# Altium project SoldeerstationFinaal.PrjPcb
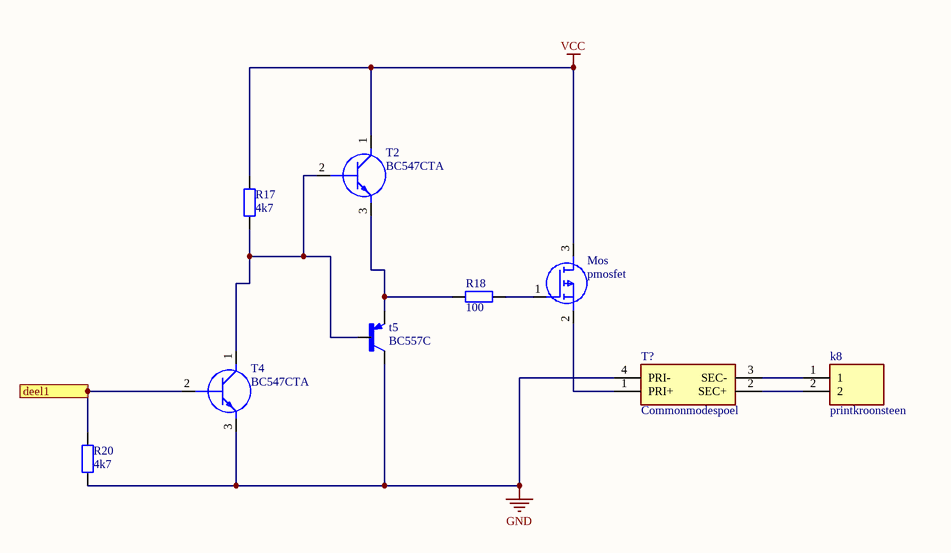
[diagram p0: deel1.SchDoc]
4 sheets, 73 parts. Net scope: flat (ports and power ports of the same name join across sheets).
Board file: PCB1.PcbDoc
Sheets:
  deel1.SchDoc
  deel2.SchDoc
  deel3.SchDoc
  deel4.SchDoc

## Sheet deel1.SchDoc
size A4; SheetNumber: 1; SheetTotal: 4

### Parts
k8  printkroonsteen  [printkroonsteen]
Mos  pmosfet  [pmosfet]
R17  4k7  [0805]
R18  100  [0805]
R20  4k7  [0805]
T2  BC547CTA  [bc447]
T4  BC547CTA  [bc447]
t5  BC557C  [bc557c]
T?  Commonmodespoel  [commonmodespoel]

### Ports
deel1

### Nets
GND: R20.1 T4.3(E) t5.1(C) T?.4(PRI-)
VCC: Mos.3(D) R17.2 T2.1(C)
Netk8_1: k8.1 T?.3(SEC-)
Netk8_2: k8.2 T?.2(SEC+)
NetMos_1: Mos.1(G) R18.2
NetMos_2: Mos.2(S) T?.1(PRI+)
NetR17_1: R17.1 T2.2(B) T4.1(C) t5.2(B)
NetR18_1: R18.1 T2.3(E) t5.3(E)
Netr19_2: R20.2 T4.2(B) ; port deel1

### Library data of the parts
k8 = printkroonsteen: Connector; Manufacturer_Name: CUI Inc.; Manufacturer_Part_Number: TB007-508-02BE; Datasheet Link: https://componentsearchengine.com//TB007-508-02BE.pdf; Height: 14mm; Mouser2 Part Number: 490-TB007-508-02BE; Mouser2 Price/Stock: https://www.mouser.com/Search/Refine.aspx?Keyword=490-TB007-508-02BE
Mos = pmosfet: MOSFET (P-Channel); Manufacturer_Name: Infineon; Manufacturer_Part_Number: IRF9Z34NPBF; Datasheet Link: https://componentsearchengine.com//IRF9Z34NPBF.pdf; Height: 4.69mm; Mouser2 Part Number: 942-IRF9Z34NPBF; Mouser2 Price/Stock: https://www.mouser.com/Search/Refine.aspx?Keyword=942-IRF9Z34NPBF
R17 R18 R20 = weerstand0805: WRIS-PSMB SMT Metal Plate Resistor, size 0805, 5mOhm, 0.5W; Manufacturer: Wurth Elektronik; Manufacturer Part Number: 580060720003; Rated Current: 10A; Temperature Coefficient of Resistance: +/-100ppm/degC; Technical Reference: MB0805R005F102KAATP0000; Resistance Tolerance: +/-1%; ComponentLink1Description: Manufacturer; ComponentLink1URL: http://www.we-online.de; ComponentLink2Description: Datasheet; ComponentLink2URL: https://www.we-online.com/catalog/datasheet/580060720003.pdf; Rated Power: 0.5W; Resistance: 5mOhm; Mounting Technology: SMT; Height: 0.35mm; Packaging: Tape and Reel; Published Date: May 2020; Size: 0805; Length: 2mm; Operating Temperature: -55 to +155degC; Width: 1.25mm
T2 T4 = BC547CTA: Transistor BJT NPN; Manufacturer_Name: ON Semiconductor; Datasheet Link: http://www.onsemi.com/pub/Collateral/BC550-D.pdf; Manufacturer_Part_Number: BC547CTA
t5 = BC557C: Bipolar (BJT) Transistor PNP 30V 100mA 150MHz 500mW Through Hole TO-92-3; MP: BC557CZL1G; Package: None; Price: None; Value: *; Availability: Unavailable
T? = Commonmodespoel: Transformer; Manufacturer_Name: Laird Technologies; Manufacturer_Part_Number: CM2545X171B-10; Datasheet Link: https://datasheet.datasheetarchive.com/originals/dk/DKDS-7/122753.pdf; Height: 9.5mm

## Sheet deel2.SchDoc
size A4; SheetNumber: 2; SheetTotal: 4
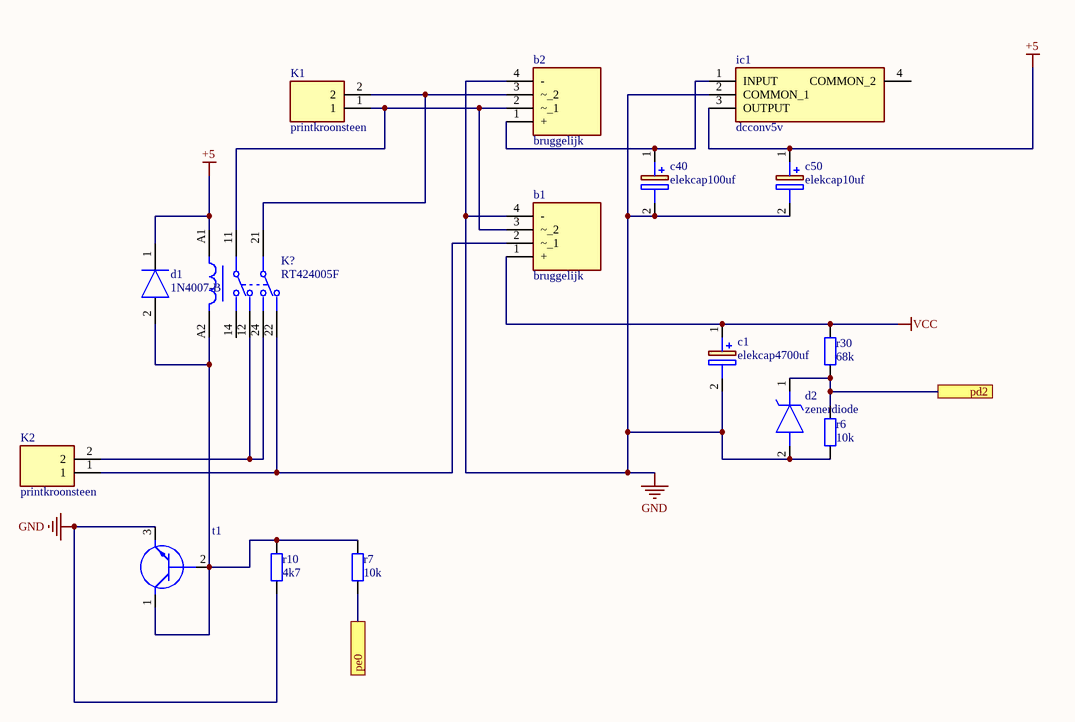
[diagram p1: deel2.SchDoc]

### Parts
(Parts that share a designator on the sheet are numbered #1, #2 ... from top to bottom, then left to right.)
b1  bruggelijk  [bruggelijk]
b2  bruggelijk  [bruggelijk]
c1  elekcap4700uf  [Elekcap4700uf]
c40  elekcap100uf  [elekcap100uf]
c50#1  elekcap10uf  [elekcap10uf]
d1  1N4007-B  [1n4007]
d2  zenerdiode  [zenerdiode]
ic1  dcconv5v  [dcconv5v]
K1  printkroonsteen  [printkroonsteen]
K2  printkroonsteen  [printkroonsteen]
K?  RT424005F  [FP-RT424005F-MFG]
r6  10k  [0805]
r7  10k  [0805]
r10  4k7  [0805]
r30  68k  [0805]
t1  (no value)  [bc447]

### Ports
pd2, pe0

### Nets
+5: c50#1.1(+) d1.1(K) ic1.3(OUTPUT) K?.A1
GND: b1.4(-) b2.4(-) c1.2(-) c40.2(-) c50#1.2(-) d2.2(A) ic1.2(COMMON_1) r6.1 r10.1 t1.3(E)
VCC: b1.1(+) c1.1(+) r30.2
Netb1_2: b1.2(~_1) K2.1 K?.22
Netb1_3: b1.3(~_2) b2.2(~_1) K1.1 K?.11
Netb2_1: b2.1(+) c40.1(+) ic1.1(INPUT)
Netb2_3: b2.3(~_2) K1.2 K?.21
Netd1_2: d1.2(A) K?.A2 r7.2 r10.2 t1.1(C) t1.2(B)
Netd2_1: d2.1(K) r6.2 r30.1 ; port pd2
NetIC5_19: r7.1 ; port pe0
NetK2_2: K2.2 K?.12 K?.24

Not connected (* = marked no-connect by the designer): ic1 4(COMMON_2); K? 14

### Library data of the parts
b1 b2 = bruggelijk: Bridge Rectifier; Manufacturer_Name: Vishay; Manufacturer_Part_Number: GBU6J-E3/45; Datasheet Link: http://www.vishay.com/docs/88615/gbu6a.pdf; Height: 18.8mm
c1 = elekcap4700uf: Capacitor Polarised; Manufacturer_Name: Kemet; Manufacturer_Part_Number: ESK478M050AQ3AA; Datasheet Link: https://componentsearchengine.com//ESK478M050AQ3AA.pdf; Height: 37mm; Mouser2 Part Number: 80-ESK478M050AQ3AA; Mouser2 Price/Stock: https://www.mouser.com/Search/Refine.aspx?Keyword=80-ESK478M050AQ3AA
c40 = elekcap100uf: Capacitor Polarised; Manufacturer_Name: Kemet; Manufacturer_Part_Number: ESH107M050AG3KA; Datasheet Link: https://connect.kemet.com:7667/gateway/IntelliData-ComponentDocumentation/1.0/download/specsheet/ESH107M050AG3KA; Height: 12.5mm
c50#1 = elekcap10uf: Capacitor Polarised; Manufacturer_Name: Panasonic; Manufacturer_Part_Number: EEU-FR1H100; Datasheet Link: https://componentsearchengine.com//EEU-FR1H100.pdf; Height: 12.5mm; Mouser2 Part Number: 667-EEU-FR1H100; Mouser2 Price/Stock: https://www.mouser.com/Search/Refine.aspx?Keyword=667-EEU-FR1H100
d1 = 1N4007-B: Diode; Manufacturer_Name: Rectron; Datasheet Link: https://www.arrow.com/en/products/1n4007-b/rectron; Manufacturer_Part_Number: 1N4007-B
d2 = zenerdiode: Zener Diode; Manufacturer_Name: Vishay; Manufacturer_Part_Number: TZMC5V1-GS08; Datasheet Link: https://componentsearchengine.com/Datasheets/2/TZMC5V1-GS08.pdf; Height: 1.6mm
ic1 = dcconv5v: Integrated Circuit; Manufacturer_Name: Texas Instruments; Manufacturer_Part_Number: TL780-05CKTTR; Datasheet Link: http://www.ti.com/general/docs/suppproductinfo.tsp?distId=26&gotoUrl=http%3A%2F%2Fwww.ti.com%2Flit%2Fgpn%2Ftl780; Height: 5.08mm
K1 K2 = printkroonsteen: as k8 on sheet deel1; Datasheet Link: https://componentsearchengine.com//TB007-508-02BE.pdf; Height: 14mm; Mouser2 Part Number: 490-TB007-508-02BE; Mouser2 Price/Stock: https://www.mouser.com/Search/Refine.aspx?Keyword=490-TB007-508-02BE
K? = CMP-03395-000296-1: RELAY GENERAL PURPOSE DPDT 8A 5V; Power Consumption: 400mW; Coil Current: 80.6mA; Max Voltage Rating (AC): 400V; Coil Power: 500mW; Dropout Voltage: 500mV; Operate Time: 7ms; Contact Voltage Rating (AC): 250V; Coil Type: Non-Latching; Coil Resistance: 62R; Release Time: 3ms; Max Operating Temperature: 85°C; Package Quantity: 5000; Relay Type: General Purpose; Series: RT2; Lead Free: Lead Free; Coil Voltage (DC): 5V; Contact Current Rating: 8A; Packaging: Carton; Height: 15.7mm; Mount: Through Hole; Width: 12.7mm; ELV: Compliant; Termination: PCB; Contact Material: Silver; Throw Configuration: DPDT; Min Operating Temperature: -40°C; Weight: 13g; RoHS Compliant: Yes; Length: 29mm; Radiation Hardening: No
r6 r7 r10 r30 = weerstand0805: as R17 on sheet deel1; ComponentLink1Description: Manufacturer; ComponentLink1URL: http://www.we-online.de; ComponentLink2Description: Datasheet; ComponentLink2URL: https://www.we-online.com/catalog/datasheet/580060720003.pdf; Rated Power: 0.5W; Resistance: 5mOhm; Mounting Technology: SMT; Height: 0.35mm; Packaging: Tape and Reel; Published Date: May 2020; Size: 0805; Length: 2mm; Operating Temperature: -55 to +155degC; Width: 1.25mm
t1 = BC547CTA: as T2 on sheet deel1; Datasheet Link: http://www.onsemi.com/pub/Collateral/BC550-D.pdf; Manufacturer_Part_Number: BC547CTA

## Sheet deel3.SchDoc
size A4; SheetNumber: 3; SheetTotal: 4
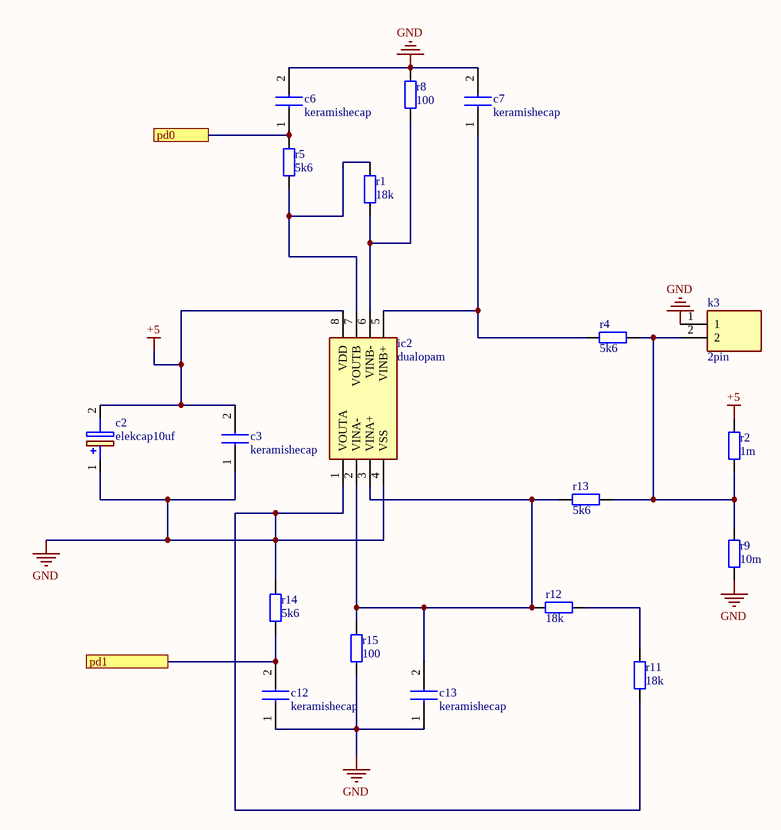
[diagram p2: deel3.SchDoc]

### Parts
c2  elekcap10uf  [elekcap10uf]
c3  keramishecap  [0805]
c6  keramishecap  [0805]
c7  keramishecap  [0805]
c12  keramishecap  [0805]
c13  keramishecap  [0805]
ic2  dualopam  [dualopam]
k3  2pin  [2pin]
r1  18k  [0805]
r2  1m  [0805]
r4  5k6  [0805]
r5  5k6  [0805]
r8  100  [0805]
r9  10m  [0805]
r11  18k  [0805]
r12  18k  [0805]
r13  5k6  [0805]
r14  5k6  [0805]
r15  100  [0805]

### Ports
pd0, pd1

### Nets
+5: c2.2(-) c3.2 ic2.8(VDD) r2.2
GND: c2.1(+) c3.1 c6.2 c7.2 c12.1 c13.1 ic2.1(VOUTA) ic2.4(VSS) k3.1 r8.2 r9.1 r11.1 r14.2 r15.1
Netc6_1: c6.1 r5.1 ; port pd0
Netc7_1: c7.1 ic2.5(VINB+) r4.1
Netc12_2: c12.2 r14.1 ; port pd1
Netc13_2: c13.2 ic2.2(VINA-) ic2.3(VINA+) r12.1 r13.1 r15.2
Netic2_6: ic2.6(VINB-) r1.1 r8.1
Netic2_7: ic2.7(VOUTB) r1.2 r5.2
Netk3_2: k3.2 r2.1 r4.2 r9.2 r13.2
Netr11_2: r11.2 r12.2

### Library data of the parts
c2 = elekcap10uf: as c50#1 on sheet deel2; Datasheet Link: https://componentsearchengine.com//EEU-FR1H100.pdf; Height: 12.5mm; Mouser2 Part Number: 667-EEU-FR1H100; Mouser2 Price/Stock: https://www.mouser.com/Search/Refine.aspx?Keyword=667-EEU-FR1H100
c3 c6 c7 c12 c13 = keramishecap: Capacitor; Manufacturer_Name: Kemet; Manufacturer_Part_Number: C1206C104K3GACAUTO; Datasheet Link: https://www.kemet.com/specsheet/C1206C104K3GACAUTO; Height: 1.8mm
ic2 = dualopam: Integrated Circuit; Manufacturer_Name: Microchip; Manufacturer_Part_Number: MCP6002-E/P; Datasheet Link: https://componentsearchengine.com//MCP6002-E_P.pdf; Height: 5.334mm; Mouser2 Part Number: 579-MCP6002-E/P; Mouser2 Price/Stock: https://www.mouser.com/Search/Refine.aspx?Keyword=579-MCP6002-E%2FP
k3 = 2pin: Connector; Manufacturer_Name: Amphenol; Manufacturer_Part_Number: 10129378-902001BLF; Datasheet Link: https://www.mouser.co.uk/datasheet/2/18/10129378-1530218.pdf; Height: 8.43mm
r1 r2 r4 r5 r8 r9 r11-r15 = weerstand0805: as R17 on sheet deel1; ComponentLink1Description: Manufacturer; ComponentLink1URL: http://www.we-online.de; ComponentLink2Description: Datasheet; ComponentLink2URL: https://www.we-online.com/catalog/datasheet/580060720003.pdf; Rated Power: 0.5W; Resistance: 5mOhm; Mounting Technology: SMT; Height: 0.35mm; Packaging: Tape and Reel; Published Date: May 2020; Size: 0805; Length: 2mm; Operating Temperature: -55 to +155degC; Width: 1.25mm

## Sheet deel4.SchDoc
size A4; SheetNumber: 4; SheetTotal: 4
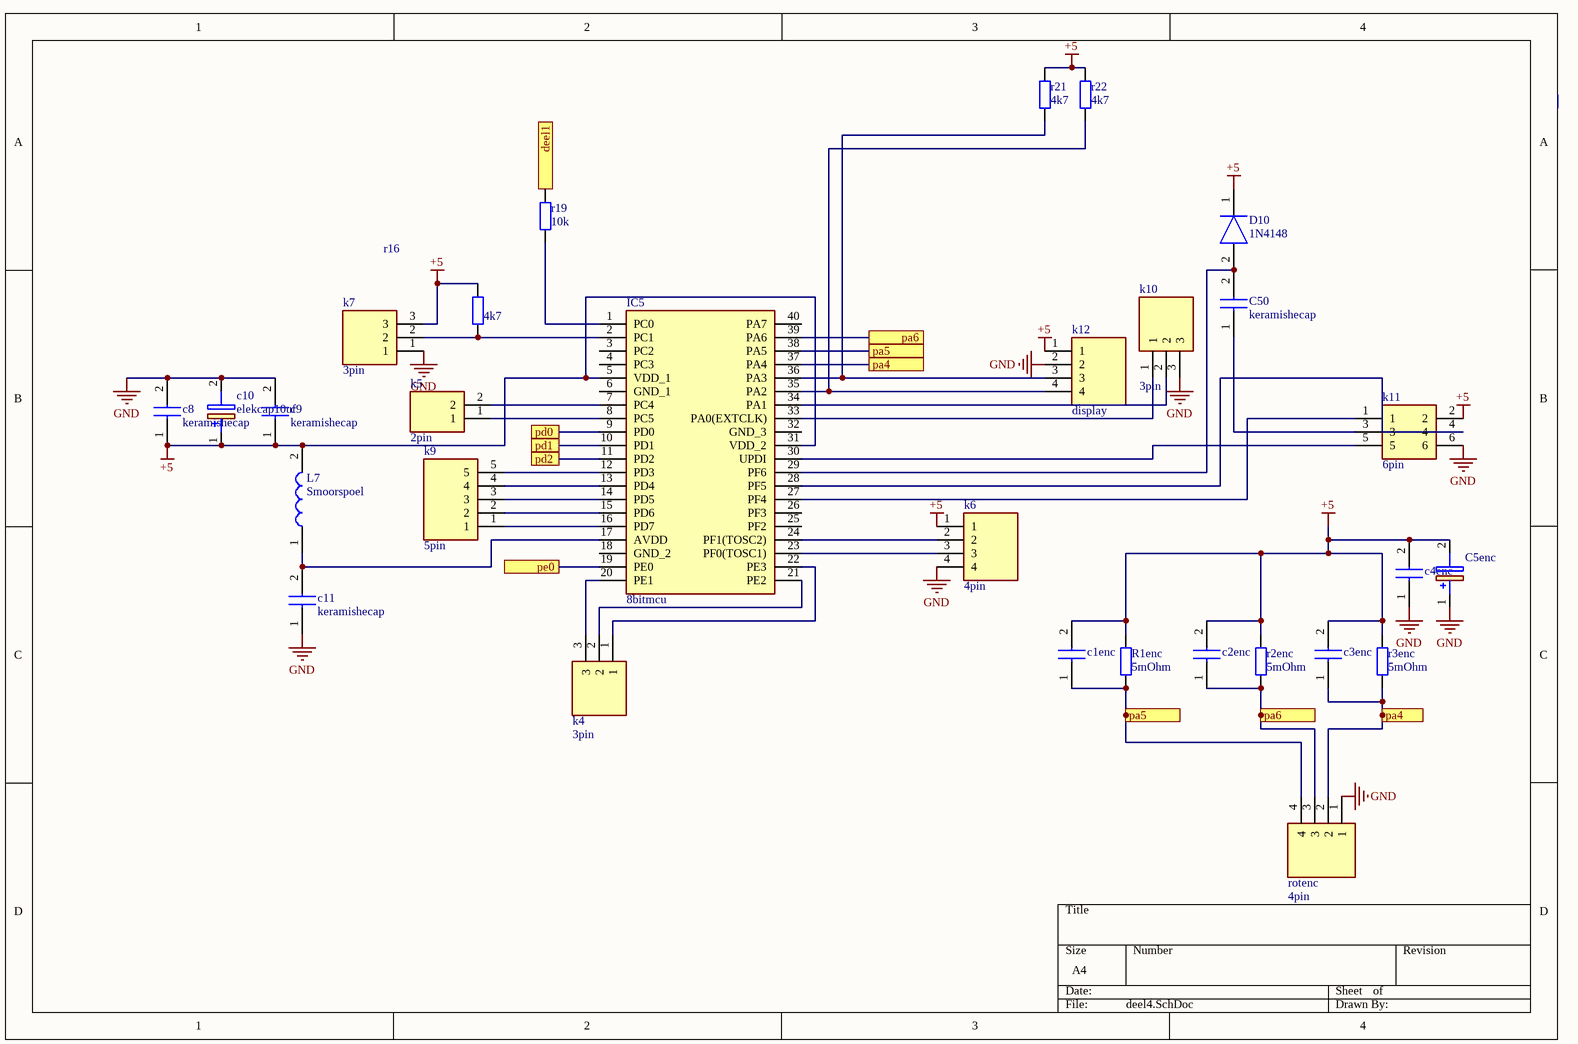
[diagram p3: deel4.SchDoc]

### Parts
(Parts that share a designator on the sheet are numbered #1, #2 ... from top to bottom, then left to right.)
c1enc  (no value)  [0805]
c2enc  (no value)  [0805]
c3enc  (no value)  [0805]
c4enc  (no value)  [0805]
C5enc  (no value)  [elekcap100uf]
c8  keramishecap  [0805]
c9  keramishecap  [0805]
c10  elekcap10uf  [elekcap10uf]
c11  keramishecap  [0805]
C50#2  keramishecap  [0805]
D10  1N4148  [diode1N4148]
IC5  8bitmcu  [8bitmcu]
k4  3pin  [3pin]
k5  2pin  [2pin]
k6  4pin  [4pin]
k7  3pin  [3pin]
k9  5pin  [5pin]
k10  3pin  [3pin]
k11  6pin  [6pin]
k12  display  [4pin]
L7  Smoorspoel  [Smoorspoel]
R1enc  5mOhm  [0805]
r2enc  5mOhm  [0805]
r3enc  5mOhm  [0805]
r16  4k7  [0805]
r19  10k  [0805]
r21  4k7  [0805]
r22  4k7  [0805]
rotenc  4pin  [4pin]

### Ports
deel1, pa4, pa5, pa6, pd0, pd1, pd2, pe0

### Nets
+5: c1enc.2 c2enc.2 c3enc.2 c4enc.2 C5enc.2(-) c8.1 c9.1 c10.1(+) D10.1(K) IC5.5(VDD_1) IC5.31(VDD_2) k6.1 k7.3 k11.2 k12.1 L7.2 R1enc.2 r2enc.2 r3enc.2 r16.2 r21.2 r22.2
GND: c4enc.1 C5enc.1(+) c8.2 c9.2 c10.2(-) c11.1 k6.4 k7.1 k10.3 k11.6 k12.2 rotenc.1
Netc1enc_1: c1enc.1 IC5.38(PA5) R1enc.1 rotenc.4 ; port pa5
Netc2enc_1: c2enc.1 IC5.39(PA6) r2enc.1 rotenc.3 ; port pa6
Netc3enc_1: c3enc.1 IC5.37(PA4) r3enc.1 rotenc.2 ; port pa4
Netc6_1: IC5.9(PD0) ; port pd0
Netc11_2: c11.2 IC5.17(AVDD) L7.1
Netc12_2: IC5.10(PD1) ; port pd1
NetC50#2_1: C50#2.1 k11.3
NetC50#2_2: C50#2.2 D10.2(A) IC5.29(PF6)
Netd2_1: IC5.11(PD2) ; port pd2
NetIC5_1: IC5.1(PC0) r19.1
NetIC5_2: IC5.2(PC1) k7.2 r16.1
NetIC5_7: IC5.7(PC4) k5.2
NetIC5_8: IC5.8(PC5) k5.1
NetIC5_12: IC5.12(PD3) k9.5
NetIC5_13: IC5.13(PD4) k9.4
NetIC5_14: IC5.14(PD5) k9.3
NetIC5_15: IC5.15(PD6) k9.2
NetIC5_16: IC5.16(PD7) k9.1
NetIC5_19: IC5.19(PE0) ; port pe0
NetIC5_20: IC5.20(PE1) k4.3
NetIC5_21: IC5.21(PE2) k4.2
NetIC5_22: IC5.22(PE3) k4.1
NetIC5_23: IC5.23(PF0(TOSC1)) k6.3
NetIC5_24: IC5.24(PF1(TOSC2)) k6.2
NetIC5_27: IC5.27(PF4) k11.1
NetIC5_28: IC5.28(PF5) k11.4
NetIC5_30: IC5.30(UPDI) k11.5
NetIC5_33: IC5.33(PA0(EXTCLK)) k10.1
NetIC5_34: IC5.34(PA1) k10.2
NetIC5_35: IC5.35(PA2) k12.4 r22.1
NetIC5_36: IC5.36(PA3) k12.3 r21.1
Netr19_2: r19.2 ; port deel1

Not connected (* = marked no-connect by the designer): IC5 3(PC2) 4(PC3) 6(GND_1) 18(GND_2) 25(PF2) 26(PF3) 32(GND_3) 40(PA7)

### Library data of the parts
c1enc c2enc c3enc c4enc c8 c9 c11 C50#2 = keramishecap: as c3 on sheet deel3; Datasheet Link: https://www.kemet.com/specsheet/C1206C104K3GACAUTO; Height: 1.8mm
C5enc = elekcap100uf: as c40 on sheet deel2; Datasheet Link: https://connect.kemet.com:7667/gateway/IntelliData-ComponentDocumentation/1.0/download/specsheet/ESH107M050AG3KA; Height: 12.5mm
c10 = elekcap10uf: as c50#1 on sheet deel2; Datasheet Link: https://componentsearchengine.com//EEU-FR1H100.pdf; Height: 12.5mm; Mouser2 Part Number: 667-EEU-FR1H100; Mouser2 Price/Stock: https://www.mouser.com/Search/Refine.aspx?Keyword=667-EEU-FR1H100
D10 = 1N4148: Diode; Manufacturer_Name: Nexperia; Datasheet Link: https://datasheet.datasheetarchive.com/originals/distributors/Datasheets-112/DSAP0040891.pdf; Manufacturer_Part_Number: 1N4148
IC5 = 8bitmcu: Integrated Circuit; Manufacturer_Name: Microchip; Manufacturer_Part_Number: ATMEGA4809-PF; Datasheet Link: https://componentsearchengine.com//ATMEGA4809-PF.pdf; Height: 6.35mm; Mouser2 Part Number: 556-ATMEGA4809-PF; Mouser2 Price/Stock: https://www.mouser.com/Search/Refine.aspx?Keyword=556-ATMEGA4809-PF
k4 k7 k10 = 3pin: Connector; Manufacturer_Name: Amphenol; Manufacturer_Part_Number: 10129378-903001BLF; Height: 8.58mm
k5 = 2pin: as k3 on sheet deel3; Datasheet Link: https://www.mouser.co.uk/datasheet/2/18/10129378-1530218.pdf; Height: 8.43mm
k6 k12 rotenc = 4pin: Connector; Manufacturer_Name: Amphenol; Manufacturer_Part_Number: 10129378-904001BLF; Datasheet Link: https://cdn.amphenol-icc.com/media/wysiwyg/files/drawing/10129378.pdf; Height: 8.58mm
k9 = 5pin: Connector; Manufacturer_Name: FCI Electronics; Manufacturer_Part_Number: 10129378-905001BLF; Datasheet Link: https://cdn.amphenol-icc.com/media/wysiwyg/files/drawing/10129378.pdf; Height: 8.58mm
k11 = 6pin: Connector; Manufacturer_Name: Amphenol; Manufacturer_Part_Number: 10129381-906002BLF; Datasheet Link: https://componentsearchengine.com//10129381-906002BLF.pdf; Height: 8.58mm; Mouser2 Part Number: 649-1012938190602BLF; Mouser2 Price/Stock: https://www.mouser.com/Search/Refine.aspx?Keyword=649-1012938190602BLF
L7 = Smoorspoel: Inductor; Manufacturer_Name: Murata Electronics; Manufacturer_Part_Number: LQM18FN1R0M00D; Datasheet Link: https://psearch.en.murata.com/inductor/product/LQM18FN1R0M00%23.html; Height: 0.9mm
R1enc r2enc r3enc r16 r19 r21 r22 = weerstand0805: as R17 on sheet deel1; ComponentLink1Description: Manufacturer; ComponentLink1URL: http://www.we-online.de; ComponentLink2Description: Datasheet; ComponentLink2URL: https://www.we-online.com/catalog/datasheet/580060720003.pdf; Rated Power: 0.5W; Resistance: 5mOhm; Mounting Technology: SMT; Height: 0.35mm; Packaging: Tape and Reel; Published Date: May 2020; Size: 0805; Length: 2mm; Operating Temperature: -55 to +155degC; Width: 1.25mm

## Nets that join several sheets
+5: deel2 (c50#1.1 d1.1 ic1.3 K?.A1), deel3 (c2.2 c3.2 ic2.8 r2.2), deel4 (22 pins)
GND: deel1 (R20.1 T4.3 t5.1 T?.4), deel2 (10 pins), deel3 (14 pins), deel4 (12 pins)
VCC: deel1 (Mos.3 R17.2 T2.1), deel2 (b1.1 c1.1 r30.2)
Netc6_1: deel3 (c6.1 r5.1), deel4 (IC5.9)
Netc12_2: deel3 (c12.2 r14.1), deel4 (IC5.10)
Netd2_1: deel2 (d2.1 r6.2 r30.1), deel4 (IC5.11)
NetIC5_19: deel2 (r7.1), deel4 (IC5.19)
Netr19_2: deel1 (R20.2 T4.2), deel4 (r19.2)